# EasyEDA Pro project ProPrj_辉光管时钟V2.0_2025-10-09.epro, board 驱动
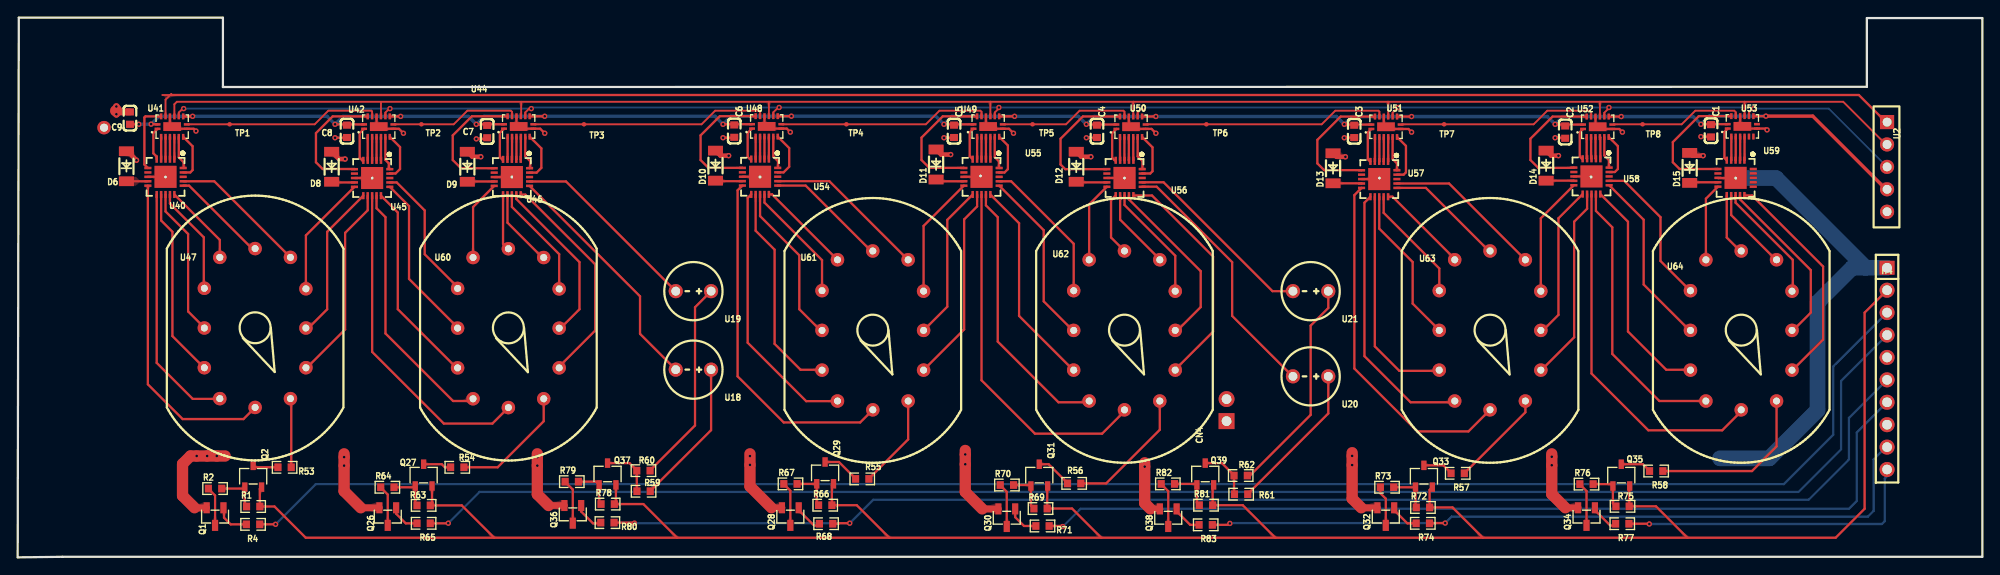
[diagram p5: board, top side]
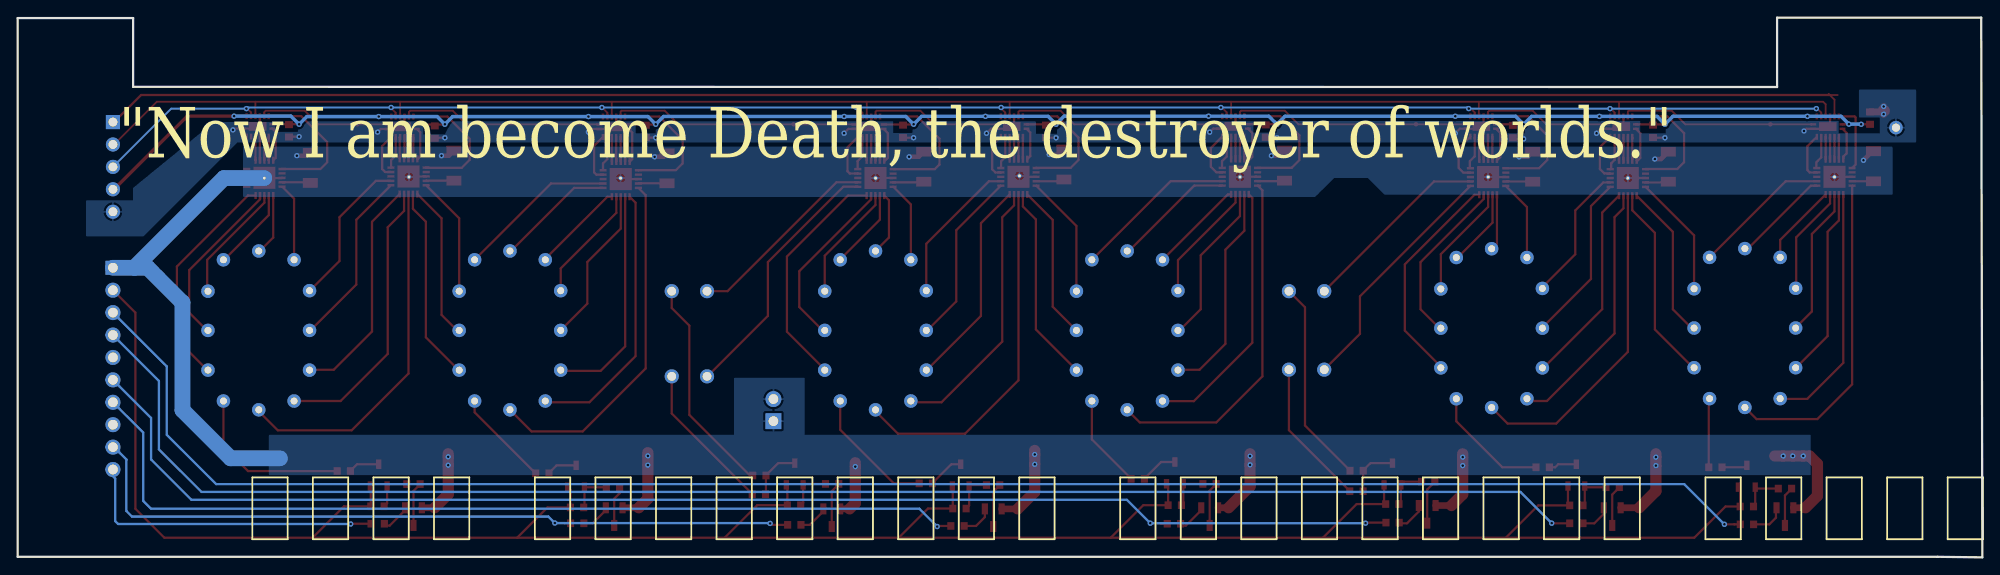
[diagram p6: board, bottom side, seen from below]

Outline 222.5 x 61.15 mm; copper layers: Top Layer, Bottom Layer. Coordinates in mm from the lower left corner of the outline.
Outline path: 0,0 5.08,0.06 222.5,0.06 222.5,61.1 209.43,61.1 209.43,53.31 23.24,53.29 23.24,61.15 0.13,61.15 0,0
Stack: Top Layer 0.035mm / Dielectric1 1.51mm FR4 er 4.5 / Bottom Layer 0.035mm

## Design rules (mm)
template: JLCPCB Capability(Two Layers Board)
spacing copperThickness1oz (default): track to track 0.102, other pairs 0.152 to 0.3
spacing copperThickness2oz: track to track 0.203, other pairs 0.152 to 0.3
track width copperThickness1oz (default): min 0.127, default 0.254, max 2.54
track width copperThickness2oz: min 0.203, default 0.254, max 2.54
differential pair differentialPair (default): width min 0.127, default 0.254, max 2.54; gap min 0.152, default 0.152
via viaSize (default): diameter min 0.5, default 0.61, max 10; hole min 0.3, default 0.305, max 6.3

## Placement (name value [footprint] x y rotation side)
C1  100nF  [C0603]  191.78 48.33 270 top
C2  100nF  [C0603]  175.26 48.18 270 top
C3  100nF  [C0603]  151.37 48.26 270 top
C4  100nF  [C0603]  122.23 48.27 270 top
C5  100nF  [C0603]  106.04 48.27 270 top
C6  100nF  [C0603]  81.15 48.29 270 top
C7  100nF  [C0603]  53.17 48.24 270 top
C8  100nF  [C0603]  37.29 48.27 270 top
C9  100nF  [C0603]  12.72 49.77 90 top
CN4  ZX-XH2.54-2PZZ  [CONN-TH_2P-P2.50_HX25003-2A]  136.91 16.68 90 top
D6  ZMM51  [LL-34_L3.5-W1.5-RD]  12.32 44.31 90 top
D8  ZMM51  [LL-34_L3.5-W1.5-RD]  35.56 44.26 90 top
D9  ZMM51  [LL-34_L3.5-W1.5-RD]  50.93 44.26 90 top
D10  ZMM51  [LL-34_L3.5-W1.5-RD]  79.03 44.38 90 top
D11  ZMM51  [LL-34_L3.5-W1.5-RD]  104.01 44.51 90 top
D12  ZMM51  [LL-34_L3.5-W1.5-RD]  119.89 44.26 90 top
D13  ZMM51  [LL-34_L3.5-W1.5-RD]  148.97 44.08 90 top
D14  ZMM51  [LL-34_L3.5-W1.5-RD]  173.1 44.38 90 top
D15  ZMM51  [LL-34_L3.5-W1.5-RD]  189.36 44.13 90 top
H4  MH254V-11-10-1196  [HDR-TH_10P-P2.54-V-M]  211.71 21.38 270 top
NOREF  -  [Pad_e20424]  109.05 43.23 0 top
NOREF#2  -  [Pad_e2323]  9.78 48.69 0 top
NOREF#3  -  [Pad_e20421]  40.14 42.97 0 top
NOREF#4  -  [Pad_e20428]  194.58 42.97 0 top
NOREF#5  -  [Pad_e20422]  55.97 43.1 0 top
NOREF#6  -  [Pad_e20423]  84.08 43.1 0 top
NOREF#7  -  [Pad_e20426]  154.22 42.97 0 top
NOREF#8  -  [Pad_e20429]  178.19 43.1 0 top
NOREF#9  -  [Pad_e10921]  16.75 43.1 0 top
NOREF#10  -  [Pad_e20425]  125.34 42.97 0 top
Q1  MMBT5551  [SOT-23-3_L2.9-W1.3-P1.90-LS2.4-BR]  22.36 4.62 90 top
Q2  MMBTA92LT1G  [SOT-23-3_L2.9-W1.6-P1.90-LS2.8-BR]  26.67 9.19 270 top
Q26  MMBT5551  [SOT-23-3_L2.9-W1.3-P1.90-LS2.4-BR]  41.91 4.62 90 top
Q27  MMBTA92LT1G  [SOT-23-3_L2.9-W1.6-P1.90-LS2.8-BR]  45.98 9.32 270 top
Q28  MMBT5551  [SOT-23-3_L2.9-W1.3-P1.90-LS2.4-BR]  87.51 4.62 90 top
Q29  MMBTA92LT1G  [SOT-23-3_L2.9-W1.6-P1.90-LS2.8-BR]  91.44 9.57 270 top
Q30  MMBT5551  [SOT-23-3_L2.9-W1.3-P1.90-LS2.4-BR]  112.02 4.49 90 top
Q31  MMBTA92LT1G  [SOT-23-3_L2.9-W1.6-P1.90-LS2.8-BR]  115.7 9.32 270 top
Q32  MMBT5551  [SOT-23-3_L2.9-W1.3-P1.90-LS2.4-BR]  154.94 4.62 90 top
Q33  MMBTA92LT1G  [SOT-23-3_L2.9-W1.6-P1.90-LS2.8-BR]  159.26 9.19 270 top
Q34  MMBT5551  [SOT-23-3_L2.9-W1.3-P1.90-LS2.4-BR]  177.68 4.62 90 top
Q35  MMBTA92LT1G  [SOT-23-3_L2.9-W1.6-P1.90-LS2.8-BR]  181.61 9.32 270 top
Q36  MMBT5551  [SOT-23-3_L2.9-W1.3-P1.90-LS2.4-BR]  62.87 4.87 90 top
Q37  MMBTA92LT1G  [SOT-23-3_L2.9-W1.6-P1.90-LS2.8-BR]  66.81 9.44 270 top
Q38  MMBT5551  [SOT-23-3_L2.9-W1.3-P1.90-LS2.4-BR]  130.31 4.49 90 top
Q39  MMBTA92LT1G  [SOT-23-3_L2.9-W1.6-P1.90-LS2.8-BR]  134.5 9.44 270 top
R1  3K  [R0603]  26.67 5.76 0 top
R2  300K  [R0603]  22.36 7.79 0 top
R4  10K  [R0603]  26.66 3.74 180 top
R53  20K  [R0603]  30.23 10.21 180 top
R54  20K  [R0603]  49.79 10.21 180 top
R55  20K  [R0603]  95.65 8.89 180 top
R56  20K  [R0603]  119.65 8.38 180 top
R57  20K  [R0603]  163.09 9.52 180 top
R58  20K  [R0603]  185.57 9.78 180 top
R59  100K  [R0603]  70.89 7.49 180 top
R60  100K  [R0603]  70.87 9.82 180 top
R61  100K  [R0603]  138.56 7.16 180 top
R62  100K  [R0603]  138.51 9.27 180 top
R63  3K  [R0603]  45.98 5.89 0 top
R64  300K  [R0603]  41.87 7.94 0 top
R65  10K  [R0603]  45.98 3.86 180 top
R66  3K  [R0603]  91.46 5.91 0 top
R67  300K  [R0603]  87.52 8.32 0 top
R68  10K  [R0603]  91.56 3.81 180 top
R69  3K  [R0603]  115.84 5.53 0 top
R70  300K  [R0603]  112.03 8.2 0 top
R71  10K  [R0603]  116.07 3.56 180 top
R72  3K  [R0603]  159.15 5.66 0 top
R73  300K  [R0603]  155.09 7.94 0 top
R74  10K  [R0603]  159.13 3.86 180 top
R75  3K  [R0603]  181.76 5.78 0 top
R76  300K  [R0603]  177.68 8.3 0 top
R77  10K  [R0603]  181.73 3.81 180 top
R78  3K  [R0603]  66.82 6.04 0 top
R79  300K  [R0603]  62.76 8.58 0 top
R80  10K  [R0603]  66.79 3.94 180 top
R81  3K  [R0603]  134.58 5.91 0 top
R82  300K  [R0603]  130.26 8.32 0 top
R83  10K  [R0603]  134.55 3.68 180 top
TP1  -  [Test-Point-0.5mm]  24.01 49.07 0 top
TP2  -  [Test-Point-0.5mm]  45.72 49.07 0 top
TP3  -  [Test-Point-0.5mm]  64.14 49.07 0 top
TP4  -  [Test-Point-0.5mm]  93.86 49.07 0 top
TP5  -  [Test-Point-0.5mm]  114.94 49.07 0 top
TP6  -  [Test-Point-0.5mm]  134.62 49.07 0 top
TP7  -  [Test-Point-0.5mm]  161.55 49.07 0 top
TP8  -  [Test-Point-0.5mm]  184.03 49.07 0 top
U2  -  [2.54mm1*5]  211.71 44.24 270 top
U18  -  [6*13氖泡]  76.53 21.27 180 top
U19  -  [6*13氖泡]  76.53 30.16 180 top
U20  -  [6*13氖泡]  146.43 20.51 180 top
U21  -  [6*13氖泡]  146.43 30.16 180 top
U40  ULN2803A  [QFN-20_L4.0-W4.0-P0.50-BL-EP]  16.75 43.11 180 top
U41  74HC595BQ,115  [DHVQFN-16_L3.5-W2.5-P0.50-BL-EP]  17.5 48.81 0 top
U42  74HC595BQ,115  [DHVQFN-16_L3.5-W2.5-P0.50-BL-EP]  40.89 48.81 0 top
U44  74HC595BQ,115  [DHVQFN-16_L3.5-W2.5-P0.50-BL-EP]  56.74 48.82 0 top
U45  ULN2803A  [QFN-20_L4.0-W4.0-P0.50-BL-EP]  40.14 42.98 180 top
U46  ULN2803A  [QFN-20_L4.0-W4.0-P0.50-BL-EP]  55.97 43.09 180 top
U47  -  [IN12]  26.89 25.99 0 top
U48  74HC595BQ,115  [DHVQFN-16_L3.5-W2.5-P0.50-BL-EP]  84.83 48.83 0 top
U49  74HC595BQ,115  [DHVQFN-16_L3.5-W2.5-P0.50-BL-EP]  109.91 48.81 0 top
U50  74HC595BQ,115  [DHVQFN-16_L3.5-W2.5-P0.50-BL-EP]  126.09 48.8 0 top
U51  74HC595BQ,115  [DHVQFN-16_L3.5-W2.5-P0.50-BL-EP]  154.97 48.79 0 top
U52  74HC595BQ,115  [DHVQFN-16_L3.5-W2.5-P0.50-BL-EP]  178.94 48.79 0 top
U53  74HC595BQ,115  [DHVQFN-16_L3.5-W2.5-P0.50-BL-EP]  195.33 48.83 0 top
U54  ULN2803A  [QFN-20_L4.0-W4.0-P0.50-BL-EP]  84.08 43.13 180 top
U55  ULN2803A  [QFN-20_L4.0-W4.0-P0.50-BL-EP]  109.16 43.11 180 top
U56  ULN2803A  [QFN-20_L4.0-W4.0-P0.50-BL-EP]  125.36 42.99 180 top
U57  ULN2803A  [QFN-20_L4.0-W4.0-P0.50-BL-EP]  154.2 42.86 180 top
U58  ULN2803A  [QFN-20_L4.0-W4.0-P0.50-BL-EP]  178.24 43.16 180 top
U59  ULN2803A  [QFN-20_L4.0-W4.0-P0.50-BL-EP]  194.56 43 180 top
U60  -  [IN12]  55.58 25.97 0 top
U61  -  [IN12]  96.85 25.72 0 top
U62  -  [IN12]  125.35 25.72 0 top
U63  -  [IN12]  166.75 25.72 0 top
U64  -  [IN12]  195.2 25.72 0 top

## Footprints (pads in the part's own frame, mm; a bottom-side part is the same pattern mirrored in y, then rotated)
2.54mm1*5
  rect 1.6x1.6 hole 1: 1(-5.08,0)
  round 1.6 hole 1: 2(-2.54,0) 3(0,0) 4(2.54,0) 5(5.08,0)
6*13氖泡
  round 1.6 hole 1: 1(-2,0) 2(2,0)
C0603
  rect 0.8x0.9 smd: 1(-0.7,0) 2(0.7,0)
CONN-TH_2P-P2.50_HX25003-2A
  rect 1.8x1.8 hole 1.1: 1(-1.25,0)
  round 1.8 hole 1.1: 2(1.25,0)
DHVQFN-16_L3.5-W2.5-P0.50-BL-EP
  rect 0.665x0.28 smd: 1(-1.657,-0.25) 8(1.657,-0.25) 9(1.657,0.25) 16(-1.657,0.25)
  rect 0.28x0.665 smd: 2(-1.25,-1.157) 3(-0.75,-1.157) 4(-0.25,-1.157) 5(0.25,-1.157) 6(0.75,-1.157) 7(1.25,-1.157) 10(1.25,1.157) 11(0.75,1.157) 12(0.25,1.157) 13(-0.25,1.157) 14(-0.75,1.157) 15(-1.25,1.157)
  rect 2x1 smd: 17(0,0)
HDR-TH_10P-P2.54-V-M
  rect 1.575x1.7 hole 1.1: 1(-11.43,0)
  round 1.7 hole 1.1: 2(-8.89,0) 3(-6.35,0) 4(-3.81,0) 5(-1.27,0) 6(1.27,0) 7(3.81,0) 8(6.35,0) 9(8.89,0) 10(11.43,0)
IN12
  round 1.524 hole 0.8: 0(5.75,-4.501) 1(-4,-8.001) 2(-5.75,-4.501) 3(-5.75,0) 4(-5.75,4.501) 5(-4,8.001) 6(0,8.999) 7(4,8.001) 8(5.75,4.445) 9(5.75,0) DOT(0,-8.999) HV(4,-8.001)
LL-34_L3.5-W1.5-RD
  rect 1.1x1.7 smd: 1(-1.7,0) 2(1.7,0)
Pad_e2323
  round 1.524 hole 0.914: 1(0,0)
Pad_e10921
  round 0.5 hole 0.305: 22(0,0)
Pad_e20421
  round 0.5 hole 0.305: 22(0,0)
Pad_e20422
  round 0.5 hole 0.305: 22(0,0)
Pad_e20423
  round 0.5 hole 0.305: 22(0,0)
Pad_e20424
  round 0.5 hole 0.305: 22(0,0)
Pad_e20425
  round 0.5 hole 0.305: 22(0,0)
Pad_e20426
  round 0.5 hole 0.305: 22(0,0)
Pad_e20428
  round 0.5 hole 0.305: 22(0,0)
Pad_e20429
  round 0.5 hole 0.305: 22(0,0)
QFN-20_L4.0-W4.0-P0.50-BL-EP
  rect 0.28x0.8 smd: 1(-1,-2) 2(-0.5,-2) 3(0,-2) 4(0.5,-2) 5(1,-2) 11(1,2) 12(0.5,2) 13(0,2) 14(-0.5,2) 15(-1,2)
  rect 0.8x0.28 smd: 6(2,-1) 7(2,-0.5) 8(2,0) 9(2,0.5) 10(2,1) 16(-2,1) 17(-2,0.5) 18(-2,0) 19(-2,-0.5) 20(-2,-1)
  rect 2.5x2.5 smd: 21(0,0)
R0603
  rect 0.806x0.864 smd: 1(-0.753,0) 2(0.753,0)
SOT-23-3_L2.9-W1.3-P1.90-LS2.4-BR
  rect 1.25x0.7 smd: 1(1,-0.95) 2(1,0.95) 3(-1,0)
SOT-23-3_L2.9-W1.6-P1.90-LS2.8-BR
  rect 1.07x0.6 smd: 1(1.235,-0.95) 2(1.235,0.95) 3(-1.235,0)
Test-Point-0.5mm
  round 0.5 smd: 1(0,0)

## Nets
As in the schematic, except:
GND: C1.2 C2.2 C3.2 C4.2 C5.2 C6.2 C7.2 C8.2 C9.2 NOREF#2.1 U2.5 U41.8 U41.13 U41.17 U42.8 U42.13 U42.17 U44.8 U44.13 U44.17 U48.8 U48.13 U48.17 U49.8 U49.13 U49.17 U50.8 U50.13 U50.17 U51.8 U51.13 U51.17 U52.8 U52.13 U52.17 U53.8 U53.13 U53.17
PGND: CN4.1 CN4.2 D6.2 D8.2 D9.2 D10.2 D11.2 D12.2 D13.2 D14.2 D15.2 H4.1 NOREF.22 NOREF#3.22 NOREF#4.22 NOREF#5.22 NOREF#6.22 NOREF#7.22 NOREF#8.22 NOREF#9.22 NOREF#10.22 Q1.2 Q26.2 Q28.2 Q30.2 Q32.2 Q34.2 Q36.2 Q38.2 U40.8 U40.21 U45.8 U45.21 U46.8 U46.21 U54.8 U54.21 U55.8 U55.21 U56.8 U56.21 U57.8 U57.21 U58.8 U58.21 U59.8 U59.21

Pads without a net: H4 5 8; U40 7 18; U45 7 18; U46 7 18; U53 6 7 9; U54 7 18; U55 7 18; U56 7 18; U57 7 18; U58 7 18; U59 7 16 17 18 19 20

## Via types
v1: diameter 0.61, hole 0.305, Top Layer to Bottom Layer, 80 vias

## Routing (per net, layer and track width the routed paths; a pad name or vN(x,y) marks a point on that pad's centre or on a via; arc(x,y) is an arc through that point)
170V: length 286.5
  Top Layer w0.254: 142.44,2.22 138.75,5.91 R81.2 135.33,8.09 Q39.2 ; 142.44,2.22 165.94,2.22 ; 142.44,2.22 122.72,2.22 ; 189.11,2.22 205.89,2.22 209.17,5.51 209.17,27.73 H4.2 ; 189.11,2.22 185.54,5.78 R75.2 182.51,8.03 Q35.2 ; 189.11,2.22 165.94,2.22 ; 98.72,2.22 95.03,5.91 R66.2 92.21,8.15 Q29.2 ; 98.72,2.22 122.72,2.22 ; 98.72,2.22 74.68,2.22 ; 165.94,2.22 162.5,5.66 R72.2 159.9,7.65 Q33.2 ; 122.72,2.22 119.41,5.53 R69.2 116.6,8.03 Q31.2 ; 74.68,2.22 70.86,6.04 R78.2 67.76,6.22 Q37.2 ; 74.68,2.22 53.96,2.22 ; 53.96,2.22 32.63,2.22 29.09,5.76 R1.2 27.43,7.76 Q2.2 ; 53.96,2.22 50.3,5.89 R63.2 46.93,6.08 Q27.2
+5V: length 248.5
  Top Layer w0.254: v1(190.63,49.07) 190.65,49.08 U53.16 ; v1(174.12,49.07) 174.15,49.04 U52.16 ; C9.1 13.72,49.07 v1(13.72,49.07) ; v1(35.94,49.07) 35.96,49.06 U42.16 ; U48.10 v1(87.63,49.99) ; U53.10 v1(197.99,49.99) ; U49.16 104.91,49.06 v1(104.91,49.07) ; U42.10 v1(43.37,49.96) ; U50.10 v1(128.91,49.95) ; U41.10 19.8,49.96 v1(19.81,49.97) ; U48.16 79.9,49.08 v1(79.89,49.07) ; U50.16 121.06,49.05 v1(121.03,49.07) ; U52.10 v1(181.61,49.94) ; U44.10 v1(59.69,49.98) ; U41.16 15.81,49.08 v1(15.11,49.08) ; U51.16 150.28,49.04 v1(150.25,49.07) ; U51.10 v1(157.86,49.94) ; v1(51.95,49.07) 51.95,49.07 U44.16 ; U49.10 v1(112.9,49.97)
  Top Layer w0.381: v1(197.99,49.99) 203.3,49.99 211.59,41.7
  Bottom Layer w0.381: v1(197.99,49.99) 191.55,49.99 v1(190.63,49.07) 189.75,49.94 v1(181.61,49.94) 175,49.94 v1(174.12,49.07) 173.24,49.94 v1(157.86,49.94) 151.12,49.94 v1(150.25,49.07) 149.36,49.95 v1(128.91,49.95) 121.92,49.95 v1(121.03,49.07) 120.13,49.97 v1(112.9,49.97) 105.81,49.97 v1(104.91,49.07) 103.99,49.99 v1(87.63,49.99) 80.81,49.99 v1(79.89,49.07) 78.98,49.98 v1(59.69,49.98) 52.86,49.98 v1(51.95,49.07) 51.05,49.96 v1(43.37,49.96) 36.84,49.96 v1(35.94,49.07) 35.04,49.97 v1(19.81,49.97) 16,49.97 v1(15.11,49.08) 13.74,49.08 v1(13.72,49.07)
GND: length 52.5
  Top Layer w0.254: C8.2 37.26,47.54 v1(35.94,47.54) ; U49.13 109.66,48.56 U49.8 112.27,48.56 v1(112.78,48.05) ; v1(190.63,47.67) 191.74,47.67 C1.2 ; v1(43.69,48.05) 43.19,48.56 41,48.56 40.64,48.91 U42.13 ; v1(87.51,48.18) 87.11,48.58 U48.8 84.87,48.58 84.58,48.87 U48.13 ; C3.2 150.26,47.56 v1(150.25,47.54) ; U53.13 195.08,48.89 195.38,48.58 197.97,48.58 v1(198.12,48.43) ; 106.04,47.57 106.02,47.54 v1(104.91,47.54) ; v1(79.89,47.54) 81.1,47.54 C6.2 ; v1(20.2,48.31) 19.95,48.56 U41.8 17.8,48.56 17.25,49.11 U41.13 ; 154.72,49.94 154.72,48.66 154.84,48.54 U51.8 157.51,48.54 v1(157.87,48.18) ; C7.2 53.04,47.42 v1(51.95,47.42) ; 125.84,49.95 125.84,48.91 126.21,48.55 U50.8 128.41,48.55 v1(128.91,48.05) ; 122.23,47.57 122.21,47.54 v1(121.03,47.54) ; v1(59.69,48.05) 59.18,48.57 U44.8 56.78,48.57 56.49,48.86 U44.13 ; v1(181.74,48.18) 181.38,48.54 U52.8 179.09,48.54 178.69,48.94 U52.13 ; C2.2 175.2,47.54 v1(174.12,47.54)
  Top Layer w0.762: C9.2 11.44,50.47 v1(11.18,50.21) v1(11.18,51.09)
  Top Layer w1.27: 11.1,50.59 11.18,50.67
PGND: length 157.6
  Top Layer w0.254: 194.57,42.97 192.59,42.97 U59.8 ; U56.8 U56.21 ; U55.8 U55.21 ; U54.8 U54.21 ; U45.8 U45.21 ; U46.8 U46.21 ; U58.8 U58.21 ; U57.8 U57.21 ; U40.8 U40.21
  Top Layer w0.508: D6.2 12.44,46.01 v1(13.46,44.99) ; D9.2 51.5,45.38 v1(52.45,45.38) ; D13.2 149.37,45.38 v1(150.37,45.38) ; v1(105.67,45.64) 104.59,45.64 D11.2 ; D8.2 36.39,45.13 v1(37.09,45.13) ; v1(80.52,45.51) 79.6,45.51 D10.2 ; v1(174.5,45.51) 173.67,45.51 D14.2 ; v1(121.54,45.38) 120.46,45.38 D12.2 ; 189.36,45.83 189.68,45.51 v1(190.88,45.51)
  Top Layer w0.762: Q38.2 128.29,5.49 ; Q30.2 109.24,5.49 ; Q1.2 20.03,5.62 ; Q26.2 38.86,5.62 ; Q32.2 152.17,5.62 ; Q28.2 85.36,5.62 ; Q36.2 60.12,5.87 ; Q34.2 175.28,5.62
  Top Layer w1.27: 36.97,11.73 v1(36.97,11.36) v1(36.97,10.39) 36.97,7.5 38.86,5.62 ; 152.17,5.62 151.13,6.65 v1(151.13,10.46) v1(151.13,11.5) 151.13,11.86 ; 58.85,11.73 v1(58.85,11.35) v1(58.85,10.39) 58.85,7.14 60.12,5.87 ; 128.29,5.49 127.64,6.14 v1(127.64,10.28) 127.64,10.71 ; 173.74,11.73 v1(173.74,11.4) v1(173.74,10.44) 173.74,7.16 175.28,5.62 ; 82.94,11.73 v1(82.94,10.48) 82.94,8.05 85.36,5.62 ; 107.32,12.11 v1(107.32,11.66) v1(107.32,10.54) 107.32,7.41 109.24,5.49 ; 20.03,5.62 18.67,6.97 18.67,10.59 19.57,11.48 v1(20.27,11.48) v1(21.46,11.48) v1(22.55,11.48) 23.5,11.48
  Bottom Layer w1.778: 209.3,32.81 207.78,32.81 203.84,28.87 203.84,16.68 198.38,11.22 192.79,11.22 ; 209.3,32.81 H4.1 ; 209.3,32.81 199.14,42.97 194.57,42.97
  vias: v1(82.94,11.48)
A0: length 2.7
  Top Layer w0.254: U42.2 U45.4
A1: length 3.8
  Top Layer w0.254: U41.1 15.37,48.08 15.37,45.78 15.75,45.4 U40.5
A2: length 2.5
  Top Layer w0.254: U41.2 16.25,45.11
A3: length 2.5
  Top Layer w0.254: U41.3 U40.3
A4: length 2.5
  Top Layer w0.254: U41.4 17.25,45.11
A5: length 2.5
  Top Layer w0.254: U41.5 U40.1
A6: length 3.8
  Top Layer w0.254: U40.20 18.8,44.16 18.8,44.77 18.25,45.31 U41.6
A7: length 5.4
  Top Layer w0.254: U40.19 19.55,43.61 19.81,43.88 19.81,46.58 U41.7
A8: length 14.6
  Top Layer w0.254: U45.6 38.12,44 34.54,44 33.78,44.77 33.78,48.07 35.68,49.96 U42.15
A9: length 4
  Top Layer w0.254: U42.1 38.73,48.05 38.73,45.27 39.03,44.98 U45.5
A_HV: length 7.8
  Top Layer w0.254: R53.1 30.98,17.9 30.89,17.98
ADOT: length 7.8
  Top Layer w0.254: U41.15 14.46,49.96 14.35,49.85 14.35,44.51 U40.6
B0: length 2.6
  Top Layer w0.254: U46.1 56.99,45.11 U44.5
B1: length 2.7
  Top Layer w0.254: U42.4 U45.2
B2: length 2.7
  Top Layer w0.254: U42.5 U45.1
B3: length 3.9
  Top Layer w0.254: U42.6 41.64,45.03 42.04,44.64 42.04,44.09 U45.20
B4: length 5.5
  Top Layer w0.254: U42.7 43.31,46.48 43.31,44 42.8,43.5 42.16,43.5 U45.19
B5: length 15
  Top Layer w0.254: U44.15 51.44,49.98 49.28,47.81 49.28,45.02 50.2,44.09 U46.6
B6: length 3.9
  Top Layer w0.254: U44.1 54.61,48.1 54.61,45.34 54.86,45.09 U46.5
B7: length 2.6
  Top Layer w0.254: U46.4 55.49,45.11 U44.2
B8: length 2.6
  Top Layer w0.254: U44.3 55.99,45.11 U46.3
B9: length 2.6
  Top Layer w0.254: U44.4 56.49,45.11 U46.2
B_HV: length 13.7
  Top Layer w0.254: U60.HV 59.58,15.42 54.36,10.21 R54.1
BDOT: length 2.7
  Top Layer w0.254: U42.3 U45.3
C0: length 2.5
  Top Layer w0.254: U49.2 108.66,45.11
C1: length 3.9
  Top Layer w0.254: U54.5 82.93,45.13 82.68,45.38 82.68,48.09 U48.1
C2: length 2.5
  Top Layer w0.254: U48.2 U54.4
C3: length 2.5
  Top Layer w0.254: U48.3 U54.3
C4: length 2.5
  Top Layer w0.254: U48.4 U54.2
C5: length 2.5
  Top Layer w0.254: U48.5 U54.1
C6: length 3.8
  Top Layer w0.254: U54.20 86.11,44.15 86.11,44.89 85.58,45.42 U48.6
C7: length 5.5
  Top Layer w0.254: U48.7 87.38,46.37 87.38,44.26 86.74,43.62 86.08,43.62 U54.19
C8: length 15
  Top Layer w0.254: U49.15 104.77,49.97 102.36,47.56 102.36,45.02 103.25,44.13 107.14,44.13 U55.6
C9: length 3.8
  Top Layer w0.254: U49.1 107.82,48.13 107.82,45.45 U55.5
C_HV: length 10.7
  Top Layer w0.254: 100.85,17.71 100.85,13.36 96.4,8.92 R55.1
CDOT: length 15
  Top Layer w0.254: U48.15 79.52,49.99 77.34,47.81 77.34,45.02 78.23,44.13 82.07,44.13 U54.6
CLK: length 206.9
  Top Layer w0.203: U53.11 196.08,50.42 196.5,50.85 v1(196.6,50.85) ; v1(18.8,50.85) 18.7,50.85 18.25,50.4 U41.11 ; v1(111.13,50.97) 111.13,50.87 110.66,50.4 U49.11 ; v1(127.51,50.97) 127.43,50.97 126.84,50.39 126.84,49.95 ; v1(42.17,50.85) 42.09,50.85 41.64,50.4 U42.11 ; 155.72,49.94 155.72,50.38 156.31,50.97 v1(156.34,50.97) ; v1(86.24,50.97) 86.13,50.97 85.58,50.42 U48.11 ; U44.11 57.49,50.41 57.92,50.85 v1(58.17,50.85) ; U52.11 179.69,50.38 180.22,50.9 v1(180.22,50.97)
  Bottom Layer w0.203: v1(18.8,50.85) v1(42.17,50.85) v1(58.17,50.85) 58.3,50.97 v1(86.24,50.97) v1(111.13,50.97) v1(127.51,50.97) v1(156.34,50.97) v1(180.22,50.97) 196.47,50.97 v1(196.6,50.85) 205.11,50.85 U2.3
CS: length 209.7
  Top Layer w0.203: 57.02,51.62 18.03,51.62 17.75,51.34 17.75,50.09 ; 57.02,51.62 57.02,50.14 56.99,50.1 ; 57.02,51.62 85.09,51.62 ; 195.58,51.62 195.58,49.99 U53.12 ; 195.58,51.62 179.19,51.62 ; 195.58,51.62 206.74,51.62 211.59,46.78 ; 85.09,51.62 85.08,51.61 85.08,50.11 ; 85.09,51.62 85.09,51.62 110.16,51.62 ; 155.19,51.62 126.34,51.62 ; 155.19,51.62 155.22,51.6 U51.12 ; 155.19,51.62 179.19,51.62 ; 126.34,51.62 126.34,50.08 ; 126.34,51.62 110.16,51.62 ; 179.19,51.62 179.19,50.07 ; 110.16,51.62 110.16,50.1 ; U42.12 41.14,51.49 41.15,51.5
D0: length 2.6
  Top Layer w0.254: 126.36,45 126.34,45.01 U50.5
D1: length 2.5
  Top Layer w0.254: U49.4 109.66,45.11
D2: length 2.5
  Top Layer w0.254: U49.5 U55.1
D3: length 3.7
  Top Layer w0.254: U55.20 111.13,44.14 111.13,44.88 110.66,45.35 U49.6
D4: length 5.2
  Top Layer w0.254: U49.7 112.15,46.67 112.15,43.99 111.76,43.61 111.17,43.61 U55.19
D5: length 16.2
  Top Layer w0.254: U56.6 118.63,43.99 118.11,44.51 118.11,47.43 120.63,49.95 124.84,49.95
D6: length 4
  Top Layer w0.254: 124.36,45 124.23,45 123.95,45.27 123.95,48.06 U50.1
D7: length 2.6
  Top Layer w0.254: 124.84,47.64 124.84,45.01 124.86,45
D8: length 2.6
  Top Layer w0.254: U50.3 125.34,45.01 125.36,45
D9: length 2.6
  Top Layer w0.254: 125.86,45 125.84,45.01 125.84,47.64
D_HV: length 14.7
  Top Layer w0.254: R56.1 123.28,8.38 129.35,14.46 U62.HV
DDOT: length 2.5
  Top Layer w0.254: U49.3 U55.3
E0: length 2.5
  Top Layer w0.254: U52.2 177.69,45.21 U58.4
E1: length 4
  Top Layer w0.254: U51.1 152.91,48.13 152.91,45.11 153.16,44.86 U57.5
E2: length 2.8
  Top Layer w0.254: U57.4 153.72,44.88 153.72,47.63
E3: length 2.8
  Top Layer w0.254: U57.3 154.22,44.88 U51.3
E4: length 2.8
  Top Layer w0.254: 154.72,47.63 154.72,44.88 U57.2
E5: length 2.8
  Top Layer w0.254: U57.1 155.22,44.88 U51.5
E6: length 4
  Top Layer w0.254: 155.72,47.63 155.72,45.13 156.21,44.64 156.21,43.87 U57.20
E7: length 5.6
  Top Layer w0.254: U57.19 156.96,43.36 157.23,43.62 157.23,46.62 U51.7
E8: length 15.1
  Top Layer w0.254: U52.15 173.84,49.94 171.32,47.43 171.32,45.02 172.21,44.13 176.21,44.13 U58.6
E9: length 3.7
  Top Layer w0.254: U52.1 176.91,48.16 176.91,45.41 177.16,45.16 U58.5
E_HV: length 11.1
  Top Layer w0.254: R57.1 170.75,16.44 U63.HV
EDOT: length 15.6
  Top Layer w0.254: U57.6 152.19,43.88 147.96,43.88 147.19,44.64 147.19,47.31 149.83,49.94 153.72,49.94
F0: length 2.7
  Top Layer w0.254: U59.1 195.58,45.02 U53.5
F1: length 2.5
  Top Layer w0.254: U52.4 178.69,45.21 U58.2
F2: length 2.5
  Top Layer w0.254: U52.5 179.24,47.58 U58.1
F3: length 3.7
  Top Layer w0.254: U58.20 180.21,44.19 180.21,45.02 179.69,45.54 U52.6
F4: length 5.2
  Top Layer w0.254: U52.7 181.23,46.59 181.23,44 180.89,43.66 U58.19
F5: length 15.6
  Top Layer w0.254: U53.15 190.39,49.99 187.45,47.05 187.45,44.77 188.21,44 192.56,44 U59.6
F6: length 3.9
  Top Layer w0.254: U59.5 193.55,45 193.29,45.25 193.29,48.21 U53.1
F7: length 2.7
  Top Layer w0.254: U53.2 194.08,45.02 U59.4
F8: length 2.7
  Top Layer w0.254: U59.3 194.58,45.02 U53.3
F9: length 2.7
  Top Layer w0.254: U59.2 195.08,45.02 U53.4
F_HV: length 19.2
  Top Layer w0.254: U64.HV 199.2,12.56 196.42,9.78 R58.1
FDOT: length 2.5
  Top Layer w0.254: U52.3 178.19,45.21 U58.3
G0: length 3.8
  Top Layer w0.254: U44.6 57.49,45.44 58.04,44.89 58.04,44.16 U46.20
G1: length 5.6
  Top Layer w0.254: U44.7 59.31,46.34 59.31,44.13 58.77,43.59 U46.19
G_HV1: length 16.6
  Top Layer w0.254: R59.1 71.64,7.52 78.53,14.41 U18.1
G_HV2: length 23.2
  Top Layer w0.254: U19.1 76.71,28.34 76.71,14.94 71.62,9.85 R60.1
H0: length 3.9
  Top Layer w0.254: 127.36,44 127.38,44.02 127.38,44.89 126.84,45.43 126.84,47.64
H1: length 5.7
  Top Layer w0.254: 127.36,43.5 127.36,43.5 128.27,43.5 128.52,43.75 128.52,46.46 U50.7
H_HV1: length 17.1
  Top Layer w0.254: R61.1 139.31,7.19 148.43,16.3 U20.1
H_HV2: length 24.7
  Top Layer w0.254: 139.48,9.19 146.44,16.15 146.44,26.26 148.43,28.26 U21.1
MOSI: length 199
  Top Layer w0.203: 17.27,52.39 16.38,52.39 ; 17.27,52.39 17.4,52.51 ; 17.27,52.39 16.75,51.86 16.75,50.22
  Top Layer w0.254: 17.27,52.39 208.52,52.39 211.59,49.32
NIX_A0: length 22.5
  Top Layer w0.254: 32.64,21.38 37.08,25.82 37.08,36.76 39.64,39.32 U45.12
NIX_A1: length 27.9
  Top Layer w0.254: 22.89,17.98 22.86,17.95 19.83,17.95 15.75,22.03 U40.11
NIX_A2: length 21.7
  Top Layer w0.254: U40.12 16.25,38.17 17.53,36.89 17.53,25.07 21.14,21.45
NIX_A3: length 16.9
  Top Layer w0.254: 21.14,26.02 19.3,27.86 19.3,36.64 16.75,39.19 U40.13
NIX_A4: length 12.2
  Top Layer w0.254: U47.4 21.08,30.55 21.08,36.26 17.25,40.09 U40.14
NIX_A5: length 9.6
  Top Layer w0.254: U40.15 22.89,35.97 U47.5 22.89,33.61
NIX_A6: length 11.6
  Top Layer w0.254: 26.89,34.98 26.89,34.64 19.41,42.11 U40.16
NIX_A7: length 15.7
  Top Layer w0.254: U47.7 22.27,42.61 U40.17
NIX_A8: length 14.2
  Top Layer w0.254: 32.64,30.05 32.64,36.48 U45.10
NIX_A9: length 18
  Top Layer w0.254: U45.11 35.05,36.89 35.05,28.11 32.64,25.7
NIX_ADOT: length 36.8
  Top Layer w0.254: U47.DOT 25.57,15.67 18.69,15.67 14.75,19.6 U40.10
NIX_B0: length 25
  Top Layer w0.254: 61.33,21.62 65.41,25.7 65.41,33.2 57.51,41.09 U46.15
NIX_B1: length 29.2
  Top Layer w0.254: U45.14 40.64,39.55 41.66,38.54 41.66,25.37 49.31,17.71 51.32,17.71 U60.1
NIX_B2: length 23.2
  Top Layer w0.254: U45.15 43.05,39.07 43.05,28.12 49.83,21.34
NIX_B3: length 19.1
  Top Layer w0.254: 49.83,26.04 44.32,31.55 44.32,39.8 U45.16
NIX_B4: length 15.5
  Top Layer w0.254: U45.17 42.93,42.48 46.1,39.3 46.1,34.34 49.83,30.62
NIX_B5: length 9.5
  Top Layer w0.254: U46.10 51.58,39.69 51.58,33.59
NIX_B6: length 6.4
  Top Layer w0.254: U46.11 54.97,35.5 55.58,34.9
NIX_B7: length 9
  Top Layer w0.254: U46.12 55.47,37.92 59.58,33.82
NIX_B8: length 12.9
  Top Layer w0.254: 61.33,30.41 61.33,34.35 55.97,39.71 U46.13
NIX_B9: length 19.2
  Top Layer w0.254: U46.14 56.47,40.61 63.63,33.45 63.63,28.11 61.33,25.81
NIX_BDOT: length 37.2
  Top Layer w0.254: 55.58,16.97 53.76,15.16 48.26,15.16 40.14,23.28 U45.13
NIX_C0: length 22.4
  Top Layer w0.254: 102.6,21.23 107.19,25.82 107.19,38.29 108.66,39.76 U55.12
NIX_C1: length 29.9
  Top Layer w0.254: U61.1 92.83,17.7 89.3,17.7 82.68,24.32 82.68,40.72 U54.11
NIX_C2: length 24.4
  Top Layer w0.254: U61.2 91.06,21.25 88.66,21.25 85.72,24.19 85.72,34.86 83.58,37.01 U54.12
NIX_C3: length 18.5
  Top Layer w0.254: U54.13 84.08,38.67 88.52,34.22 88.52,28.12 91.1,25.54
NIX_C4: length 13.9
  Top Layer w0.254: U54.14 84.58,40.2 91.1,33.68 91.1,29.96
NIX_C5: length 10.8
  Top Layer w0.254: U54.15 85.44,41.13 92.85,33.72
NIX_C6: length 13.8
  Top Layer w0.254: U54.16 89.24,42.13 96.75,34.62
NIX_C7: length 18.5
  Top Layer w0.254: 100.85,33.72 100.83,33.72 91.92,42.62 U54.17
NIX_C8: length 14.1
  Top Layer w0.254: 102.6,29.91 102.6,37.55 U55.10
NIX_C9: length 17.7
  Top Layer w0.254: U55.11 105.28,38.24 105.28,28.4 U61.9
NIX_CDOT: length 39.9
  Top Layer w0.254: U61.DOT 95.42,15.29 86.76,15.29 81.53,20.51 81.53,41.58 U54.10
NIX_D0: length 26.5
  Top Layer w0.254: 131.1,21.29 135.38,25.57 135.38,34.09 128.47,41 126.36,41
NIX_D1: length 30.5
  Top Layer w0.254: U55.14 109.66,39.88 111,38.54 111,24.45 117.87,17.57 121.21,17.57 U62.1
NIX_D2: length 23.9
  Top Layer w0.254: 119.6,21.17 113.41,27.35 113.41,37.86 U55.15
NIX_D3: length 20
  Top Layer w0.254: 119.6,25.61 116.21,29.01 116.21,37.07 U55.16
NIX_D4: length 17.1
  Top Layer w0.254: U55.17 112.51,42.61 119.6,35.53 119.6,29.84
NIX_D5: length 9.4
  Top Layer w0.254: 121.35,33.46 121.35,39.99 123.36,42
NIX_D6: length 7.1
  Top Layer w0.254: 124.36,41 123.83,40.47 123.83,36.24 125.35,34.72
NIX_D7: length 9.1
  Top Layer w0.254: 124.86,41 124.86,38.26 129.35,33.77
NIX_D8: length 13.6
  Top Layer w0.254: 125.36,41 125.36,39.92 131.1,34.18 131.1,29.78
NIX_D9: length 20.1
  Top Layer w0.254: 125.86,41 125.86,40.55 133.99,32.42 133.99,28.36 131.1,25.48
NIX_DDOT: length 41
  Top Layer w0.254: U62.DOT 125.35,16.55 122.81,14.02 115.21,14.02 109.16,20.06 U55.13
NIX_E0: length 22.2
  Top Layer w0.254: U58.12 177.74,39.5 176.28,38.03 176.28,24.93 172.5,21.16
NIX_E1: length 30.8
  Top Layer w0.254: U63.1 162.61,17.57 157.75,17.57 152.53,22.79 152.53,40.19 U57.11
NIX_E2: length 25.4
  Top Layer w0.254: U57.12 153.7,23.91 156.48,21.13 160.91,21.13 U63.2
NIX_E3: length 17.9
  Top Layer w0.254: U57.13 154.2,37.25 157.99,33.46 157.99,28.75 161,25.74
NIX_E4: length 13.6
  Top Layer w0.254: U57.14 154.7,39.04 161,32.74 161,29.84
NIX_E5: length 10.5
  Top Layer w0.254: U57.15 155.71,40.86 162.75,33.82
NIX_E6: length 13.5
  Top Layer w0.254: 166.75,34.71 166.63,34.71 159.48,41.86 U57.16
NIX_E7: length 18.1
  Top Layer w0.254: U57.17 162.11,42.36 U63.7
NIX_E8: length 13.9
  Top Layer w0.254: 172.5,29.78 172.5,38.42 U58.10
NIX_E9: length 17.6
  Top Layer w0.254: U63.9 172.54,25.68 172.7,25.68 174.5,27.47 174.5,38.42 U58.11
NIX_EDOT: length 40.1
  Top Layer w0.254: U57.10 151.38,41.04 151.38,21.4 158.51,14.27 164.3,14.27 U63.DOT
NIX_F0: length 25.5
  Top Layer w0.254: 200.95,21.16 204.47,24.68 204.47,32.95 196.42,41 U59.15
NIX_F1: length 31.7
  Top Layer w0.254: U58.14 178.74,39.25 180.59,37.4 180.59,23.05 185.93,17.71 U64.1
NIX_F2: length 25.8
  Top Layer w0.254: U64.2 189.41,21.25 186.71,21.25 182.37,25.59 182.37,38.03 U58.15
NIX_F3: length 20.4
  Top Layer w0.254: U58.16 184.15,38.25 184.15,30.91 189.45,25.61
NIX_F4: length 17.3
  Top Layer w0.254: U58.17 181.94,42.66 186.06,38.54 186.06,33.58 189.45,30.18
NIX_F5: length 9.1
  Top Layer w0.254: U59.10 191.2,40.64 191.2,33.46
NIX_F6: length 7.1
  Top Layer w0.254: U59.11 193.56,36.23 195.2,34.59
NIX_F7: length 9.8
  Top Layer w0.254: 199.39,33.45 194.06,38.78 U59.12
NIX_F8: length 13.6
  Top Layer w0.254: U64.8 201.04,30.25 201.04,33.7 194.56,40.19 U59.13
NIX_F9: length 19.6
  Top Layer w0.254: U59.14 195.06,40.57 203.08,32.55 203.08,27.73 200.95,25.6
NIX_FDOT: length 41
  Top Layer w0.254: U64.DOT 195.2,16.55 193.04,14.4 184.67,14.4 178.24,20.83 U58.13
NIX_G0: length 27.7
  Top Layer w0.254: U46.16 70.48,29.58 70.48,25.32 74.53,21.28
NIX_G1: length 21.7
  Top Layer w0.254: U19.2 62.1,42.59 U46.17
NIX_H0: length 29.6
  Top Layer w0.254: 127.36,42 128.99,42 137.54,33.45 137.54,27.35 144.43,20.46
NIX_H1: length 22.2
  Top Layer w0.254: 127.36,42.5 129.78,42.5 142.11,30.16 U21.2
SWITCH1: length 199.5
  Top Layer w0.254: R4.1 28.07,3.74 28.08,3.74 v1(29.21,3.74)
  Bottom Layer w0.254: v1(29.21,3.74) 33.77,8.3 200.03,8.3 205.62,13.89 205.62,21.64 H4.3 212.47,27.73
SWITCH2: length 179.1
  Top Layer w0.254: v1(48.77,3.87) 48.75,3.86 R65.1
  Bottom Layer w0.254: v1(48.77,3.87) 52.31,7.41 201.68,7.41 206.51,12.24 206.51,19.98 H4.4 212.47,25.19
SWITCH3: length 156.4
  Top Layer w0.254: R80.1 69.79,3.94 v1(69.85,3.87) ; R68.1 92.97,3.81 93.03,3.87 v1(94.23,3.87)
  Bottom Layer w0.254: v1(69.85,3.87) v1(94.23,3.87) 96.88,6.52 202.82,6.52 207.4,11.09 207.4,15.79 H4.6 212.47,20.11
SWITCH4: length 106.1
  Top Layer w0.254: v1(118.36,3.49) 118.3,3.56 R71.1
  Bottom Layer w0.254: v1(118.36,3.49) 120.38,5.51 207.4,5.51 208.28,6.4 208.28,14.14 H4.7 212.47,17.57
SWITCH5: length 86
  Top Layer w0.254: R83.1 137.13,3.68 v1(137.29,3.84) ; R74.1 160.55,3.86 160.58,3.89 v1(161.67,3.89)
  Bottom Layer w0.254: v1(137.29,3.84) 137.33,3.89 v1(161.67,3.89) 162.4,4.62 209.55,4.62 210.19,5.25 210.19,11.09 211.59,12.49 212.47,12.49
SWITCH6: length 35.4
  Top Layer w0.254: v1(184.79,3.78) 184.76,3.81 R77.1
  Bottom Layer w0.254: 212.47,9.95 211.46,8.94 211.46,4.11 211.13,3.78 v1(184.79,3.78)
$1N13394: length 22.2
  Top Layer w0.203: 40.14,49.84 40.14,50.51 40.05,50.61 35.18,50.61 33.64,49.07 TP1.1 19.29,49.07
$1N13396: length 14.6
  Top Layer w0.203: 42.69,49.07 TP2.1 49.39,49.07 50.93,50.61 55.86,50.61 55.99,50.47 55.99,49.85
$1N13403: length 2.5
  Top Layer w0.254: 12.38,42.61 U40.9 ; 12.38,42.61 12.32,42.56 ; 12.38,42.61 D6.1
$1N13404: length 2.6
  Top Layer w0.254: U45.9 35.64,42.48 D8.1
$1N13405: length 3.1
  Top Layer w0.254: D9.1 50.96,42.59 U46.9
$1N13668: length 3.1
  Top Layer w0.254: D10.1 79.09,42.62 U54.9
$1N13669: length 3.2
  Top Layer w0.254: U55.9 104.21,42.61 D11.1
$1N13670: length 3.5
  Top Layer w0.254: U56.9 119.96,42.49 D12.1
$1N13767: length 3.2
  Top Layer w0.254: U57.9 152.18,42.38 D13.1
$1N13768: length 3.1
  Top Layer w0.254: D14.1 176.22,42.68 U58.9
$1N13769: length 3.2
  Top Layer w0.254: U59.9 189.43,42.5 D15.1
$1N13978: length 26.9
  Top Layer w0.203: 58.52,49.07 TP3.1 77.45,49.07 78.99,50.61 83.95,50.61 84.07,50.48 84.07,49.86 84.08,49.86
$1N13979: length 23.9
  Top Layer w0.203: 86.6,49.07 TP4.1 102.85,49.07 104.39,50.61 109.03,50.61 109.16,50.48 109.16,49.84
$1N13980: length 15
  Top Layer w0.203: 111.7,49.07 TP5.1 118.73,49.07 120.27,50.61 125.23,50.61 125.35,50.49 125.35,49.83 125.34,49.83
$1N13981: length 27.7
  Top Layer w0.203: 154.22,49.82 154.22,50.5 154.11,50.61 149.22,50.61 147.69,49.07 TP6.1 127.9,49.07
$1N13982: length 22.8
  Top Layer w0.203: 156.78,49.07 TP7.1 171.69,49.07 173.23,50.61 178.05,50.61 178.19,50.47 178.19,49.82
$1N13983: length 15.1
  Top Layer w0.203: 194.58,49.86 194.58,50.44 194.41,50.61 189.99,50.61 188.45,49.07 TP8.1 180.76,49.07
$1N27497: length 4.5
  Top Layer w0.254: R2.1 21.6,7.76 22.36,7.01 Q1.3
$1N27498: length 4
  Top Layer w0.254: 23.31,5.62 23.37,5.55 23.37,4.49 24.12,3.74 R4.2
$1N27501: length 5
  Top Layer w0.254: R1.1 25.72,5.96 Q2.1 25.56,7.79 R2.2
$1N27676: length 4.7
  Top Layer w0.254: R64.1 41.12,7.91 41.91,7.11 Q26.3
$1N27677: length 3.5
  Top Layer w0.254: R65.2 43.95,3.86 42.86,4.94 Q26.1
$1N27680: length 4.7
  Top Layer w0.254: 42.62,7.94 44.89,7.94 45.03,8.08 45.03,6.08 R63.1
$1N27855: length 5
  Top Layer w0.254: R67.1 86.77,8.29 87.51,7.56 Q28.3
$1N27856: length 3.4
  Top Layer w0.254: R68.2 90.59,3.6 90.2,3.6 88.46,5.34 Q28.1
$1N27859: length 4.7
  Top Layer w0.254: R67.2 90.48,8.32 Q29.1 90.49,6.12 R66.1
$1N28034: length 5
  Top Layer w0.254: Q30.3 112.02,7.43 111.28,8.17 111.28,8.2
$1N28035: length 3.7
  Top Layer w0.254: Q30.1 112.97,4.56 113.97,3.56 R71.2
$1N28038: length 4.7
  Top Layer w0.254: R70.2 114.64,8.2 Q31.1 114.75,5.87 R69.1
$1N28072: length 3.2
  Top Layer w0.254: Q27.3 48.03,10.55 48.38,10.21 R54.2
$1N28104: length 4.3
  Top Layer w0.254: Q29.3 93.01,10.81 94.9,8.92 R55.2
$1N28136: length 4.1
  Top Layer w0.254: Q31.3 116.76,10.55 118.9,8.41 118.9,8.38
$1N28168: length 2.9
  Top Layer w0.254: R53.2 26.89,10.21 26.67,10.42
$1N28942: length 4.6
  Top Layer w0.254: Q32.3 154.94,6.64 154.33,7.26 R73.1
$1N28943: length 3.4
  Top Layer w0.254: Q32.1 155.89,5.34 157.38,3.86 R74.2
$1N28946: length 4.8
  Top Layer w0.254: R72.1 158.31,5.74 Q33.1 158.3,7.94 R73.2
$1N28950: length 5
  Top Layer w0.254: R76.1 176.92,8.27 177.68,7.52 Q34.3
$1N28951: length 3.4
  Top Layer w0.254: Q34.1 178.63,5.34 180.37,3.6 180.76,3.6 R77.2
$1N28954: length 4.8
  Top Layer w0.254: R76.2 180.44,8.3 Q35.1 180.66,6.12 R75.1
$1N28958: length 5.1
  Top Layer w0.254: 62,8.58 62,8.55 62.87,7.68 Q36.3
$1N28959: length 3.5
  Top Layer w0.254: Q36.1 63.82,5.19 65.16,3.86 65.96,3.86 R80.2
$1N28962: length 4.8
  Top Layer w0.254: 66.07,6.04 65.86,6.25 Q37.1 65.49,8.58 R79.2
$1N28966: length 5.2
  Top Layer w0.254: R82.1 129.51,8.29 130.31,7.5 Q38.3
$1N28967: length 3.4
  Top Layer w0.254: Q38.1 131.26,5.22 132.79,3.68 R83.2
$1N28970: length 5
  Top Layer w0.254: R81.1 133.55,6.19 Q39.1 133.43,8.32 131.01,8.32
$1N28974: length 3.5
  Top Layer w0.254: R58.2 184.81,9.81 184.07,10.55 Q35.3
$1N28989: length 3.5
  Top Layer w0.254: 159.26,10.42 161.46,10.42 162.33,9.55 R57.2
$1N29050: length 6
  Top Layer w0.254: 70.13,7.49 70.12,7.51 R60.2 70.12,9.85 69.29,10.68 66.81,10.68
$1N29111: length 6
  Top Layer w0.254: 134.5,10.68 136.38,10.68 137.76,9.3 R62.2 137.76,7.21 R61.2

## Copper pours and planes (outline as drawn; the poured copper is in the pictures)
GND on Bottom Layer: 214.76,40.46 209.44,40.46 209.42,41.87 200.28,49.32 193.31,49.32 193.31,48.22 193.29,48.21 190.76,48.21 190.76,49.39 176.55,49.39 176.55,47.94 176.53,47.92 174.12,47.92 173.61,48.94 173.36,49.41 152.5,49.41 152.5,48.05 150.25,48.05 150.25,49.41 123.34,49.41 123.34,48.08 121.26,48.08 121.16,48.18 121.16,49.41 107.19,49.41 107.19,47.99 104.84,47.99 104.78,48.05 104.78,49.42 82.55,49.42 82.55,48.13 82.54,48.12 79.91,48.12 79.91,49.44 54.56,49.44 54.56,48.13 54.49,48.05 51.82,48.05 51.82,49.46 38.74,49.46 38.74,48.06 38.73,48.05 35.86,48.05 35.86,49.4 35.82,49.45 16.26,49.45 16.26,48.05 11.61,48.05 11.61,49.84 13.97,49.84 13.97,53 7.49,53 7.49,47.01 197.62,47.01 208.26,36.37 214.76,36.37
PGND on Bottom Layer: 10.16,41.08 67.69,41.08 69.6,42.99 73.41,42.99 75.56,40.83 196.98,40.83 196.98,46.42 196.98,46.54 10.16,46.54
PGND on Bottom Layer: 133.37,20.35 141.38,20.35 141.38,13.89 194.06,13.89 194.06,9.32 19.44,9.32 19.44,13.89 133.37,13.89

Small or netless copper shapes (teardrops, artwork), in the pictures only: 699 on Top Layer, 71 on Bottom Layer

## Text on the board
Bottom Silkscreen Layer: श्री भगवानुवाच कालोऽस्मि लोकक्षयकृत्प्रवृद्धो | "Now I am become Death, the destroyer of worlds."
Top Silkscreen Layer: 宽距应该设置为3倍窄距+窄距-实际窄距 = 700mil
